# Altium schematic sheet Voltage Regulator.SchDoc
size A
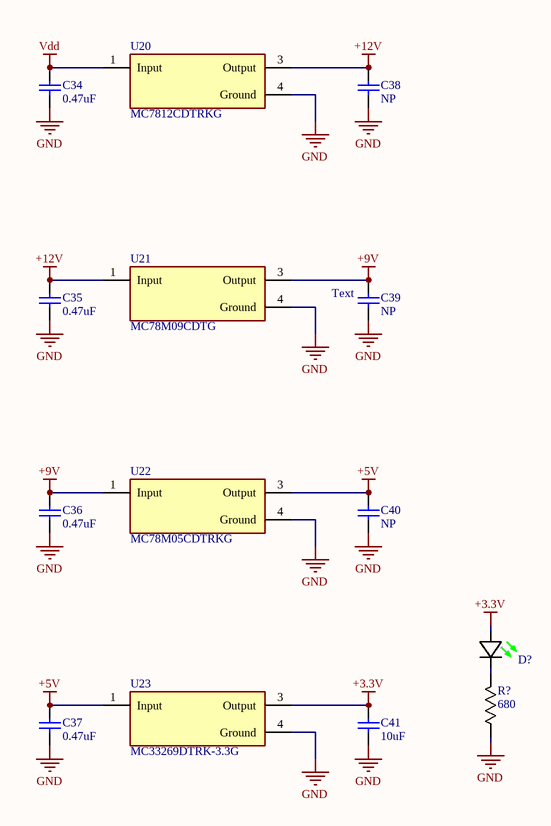
[diagram p0: Voltage Regulator.SchDoc]

## Parts
C34  0.47uF  [CAPC1210(3225)210_M]
C35  0.47uF  [CAPC1210(3225)210_M]
C36  0.47uF  [CAPC1210(3225)210_M]
C37  0.47uF  [CAPC1210(3225)210_M]
C38  NP  [CAPC1210(3225)210_M]
C39  NP  [CAPC1210(3225)210_M]
C40  NP  [CAPC1210(3225)210_M]
C41  10uF  [CAPC1210(3225)210_M]
D?  150060GS55040  [LED (0603)]  (value not drawn)
R?  value 680  [R-0603]  (hidden comment: Resistor)
U20  MC7812CDTRKG  [FP-369C-MFG]
U21  MC78M09CDTG  [FP-369C-MFG]
U22  MC78M05CDTRKG  [FP-369C-MFG]
U23  MC33269DTRK-3.3G  [FP-369C-MFG]

## Nets
+3.3V: C41.2 D?.2(A) U23.3(Output)
+5V: C37.2 C40.2 U22.3(Output) U23.1(Input)
+9V: C36.2 C39.2 U21.3(Output) U22.1(Input)
+12V: C35.2 C38.2 U20.3(Output) U21.1(Input)
GND: C34.1 C35.1 C36.1 C37.1 C38.1 C39.1 C40.1 C41.1 R?.1 U20.4(Ground) U21.4(Ground) U22.4(Ground) U23.4(Ground)
Vdd: C34.2 U20.1(Input)
NetD?_1: D?.1(K) R?.2

## Notes on the sheet
- (near C39) Text

## Library data of the parts
C34-C37 = CMP-1038-02235-1: C1210C474K5RACTU; Tolerance: Â±20%; Case-Metric: 3225; Rated Voltage: 35 V; Value: 10uF; Case-EIA: 1210; Technology: SMT; Max Thickness: 2.1 mm
C38-C40 = CMP-1038-02235-1: C1210C106K3RACTU; Tolerance: Â±20%; Case-Metric: 3225; Rated Voltage: 35 V; Value: 10uF; Case-EIA: 1210; Technology: SMT; Max Thickness: 2.1 mm
C41 = CMP-1038-02235-1: C1210C106K3RACTU; Tolerance: Â±20%; Case-Metric: 3225; Rated Voltage: 35 V; Case-EIA: 1210; Technology: SMT; Value: 10uF; Max Thickness: 2.1 mm
D? = 150060GS55040: LED GREEN DIFFUSED 0603 SMD; Manufacturer: Wurth Electronics; Lens Style: Flat; Luminous Intensity: 430mcd; Forward Voltage: 3.2V; Test Current: 20mA; Viewing Angle: 140°; Dominant Wavelength: 525nm; Lens Size: 0.8mm; Supplier 1: Mouser; Manufacturer Part Number: 150060GS55040; RoHS: No; Category: LEDs; Stock 1: 3998; Pricing 1: 1=0.23000, 10=0.21000, 50=0.21000, 100=0.19000, 1000=0.15200, 10000=0.13200 (USD); Mount: Surface Mount; Case/Package: 0603; Color: Green; Case Code (Imperial): 0603; Case Code (Metric): 1608; Packaging: Cut Tape; Lens Transparency: Diffused; Length: 1.6mm; Width: 0.8mm; Height: 0.5mm; RoHS Compliant: No; ComponentLink1URL: http://www.farnell.com/datasheets/2621642.pdf?src-supplier=Farnell; ComponentLink1Description: http://www.farnell.com/datasheets/2621642.pdf?src-supplier=Farnell; ComponentLink2URL: http://katalog.we-online.de/pbs/datasheet/150060GS55040.pdf?src-supplier=Digi-Key; ComponentLink2Description: http://katalog.we-online.de/pbs/datasheet/150060GS55040.pdf?src-supplier=Digi-Key; ComponentLink3URL: https://www.we-online.de/web/en/index.php/download/media/07_electronic_components/download_center_1/application_notes_berichte/ano002_leds___the_future_of_horticultural_lighting/ANO002b_EN_LEDs_The_Future_of_Horticultural_Lighting.pdf?src-supplier=Digi-Key; ComponentLink3Description: https://www.we-online.de/web/en/index.php/download/media/07_electronic_components/download_center_1/application_notes_berichte/ano002_leds___the_future_of_horticultural_lighting/ANO002b_EN_LEDs_The_Future_of_Horticultural_Lighting.pdf?src-supplier=Digi-Key; ComponentLink4URL: https://katalog.we-online.de/pbs/datasheet/150060GS55040.pdf?src-supplier=Digi-Key; ComponentLink4Description: https://katalog.we-online.de/pbs/datasheet/150060GS55040.pdf?src-supplier=Digi-Key; ComponentLink5URL: http://www.farnell.com/datasheets/2621642.pdf?src-supplier=Newark; ComponentLink5Description: http://www.farnell.com/datasheets/2621642.pdf?src-supplier=Newark; Supplier Part Number 1: 710-150060GS55040
U20-U23 = CMP-07128-000005-1: IC REG LINEAR 5V 1A DPAK; Manufacturer: ON Semiconductor; Manufacturer Part Number: MC7805CDTG; Number Of Outputs: 1; Standoff Height: 0mm; Output Type: Fixed; Nominal Supply Current: 3.2mA; Dropout Voltage: 2V; Max Supply Voltage: 35V; Max Junction Temp: +125°C; Min Supply Voltage: 7V; Mouser Description: Linear Voltage Regulator, Positive, 5.0 V, 1.0 A, V out : 5.0 V; T J = 0Â°C to +125Â°C; Package: 369C; Output Voltage: 5V; Octopart: https://octopart.com/mc7805cdtg-on+semiconductor-1266408; Lead Free: Yes; Temperature Range Low: 0°C; Automotive: No; Temperature Range High: +125°C; Temperature: 0°C to +125°C; RoHS: TRUE; ComponentLink2Description: Datasheet; ComponentLink2URL: https://www.onsemi.cn/PowerSolutions/document/MC7800-D.PDF; Device Class L3: Voltage Regulators - Linear; Footprint Url: https://www.onsemi.com/pub/Collateral/369C.PDF; Device Class L1: Integrated Circuits (ICs); Digikey Description: IC REG LINEAR 5V 1A DPAK; Output Current: 1A; Device Class L2: Power Management ICs; Height: 2.51mm; Category: IC